# Altium schematic sheet [05] - DISP DRIVERS.SchDoc: DISPLAY DRIVERS
size 433 x 279 mm; Author: ZAG; DrawnBy: ZAG; DocumentNumber: 6; SheetNumber: 5; SheetTotal: 7; PageSetup: Record=PageOptions|CenterHorizontal=True|CenterVertical=True|PrintScale=0.96|XCorrection=1.00|YCorrection=1.00|PrintKind=2|BorderSize=5000000|LeftOffset=0|BottomOffset=0|Orientation=2|PaperLength=4318|PaperWidth=2794|Scale=100|PaperSource=15|PrintQuality=600|MediaType=1|DitherType=10|PaperKind=11x17|PrintScaleMode=1; ClientCompanyName: Mule Labs, LLC; ClientContactEmail: zack@mule-labs.com; PCBRevision: 01; SchRevision: 01; Project: YOUTUBE SUBSCRIBER COUNTER; SchStatus: PRELIMINARY
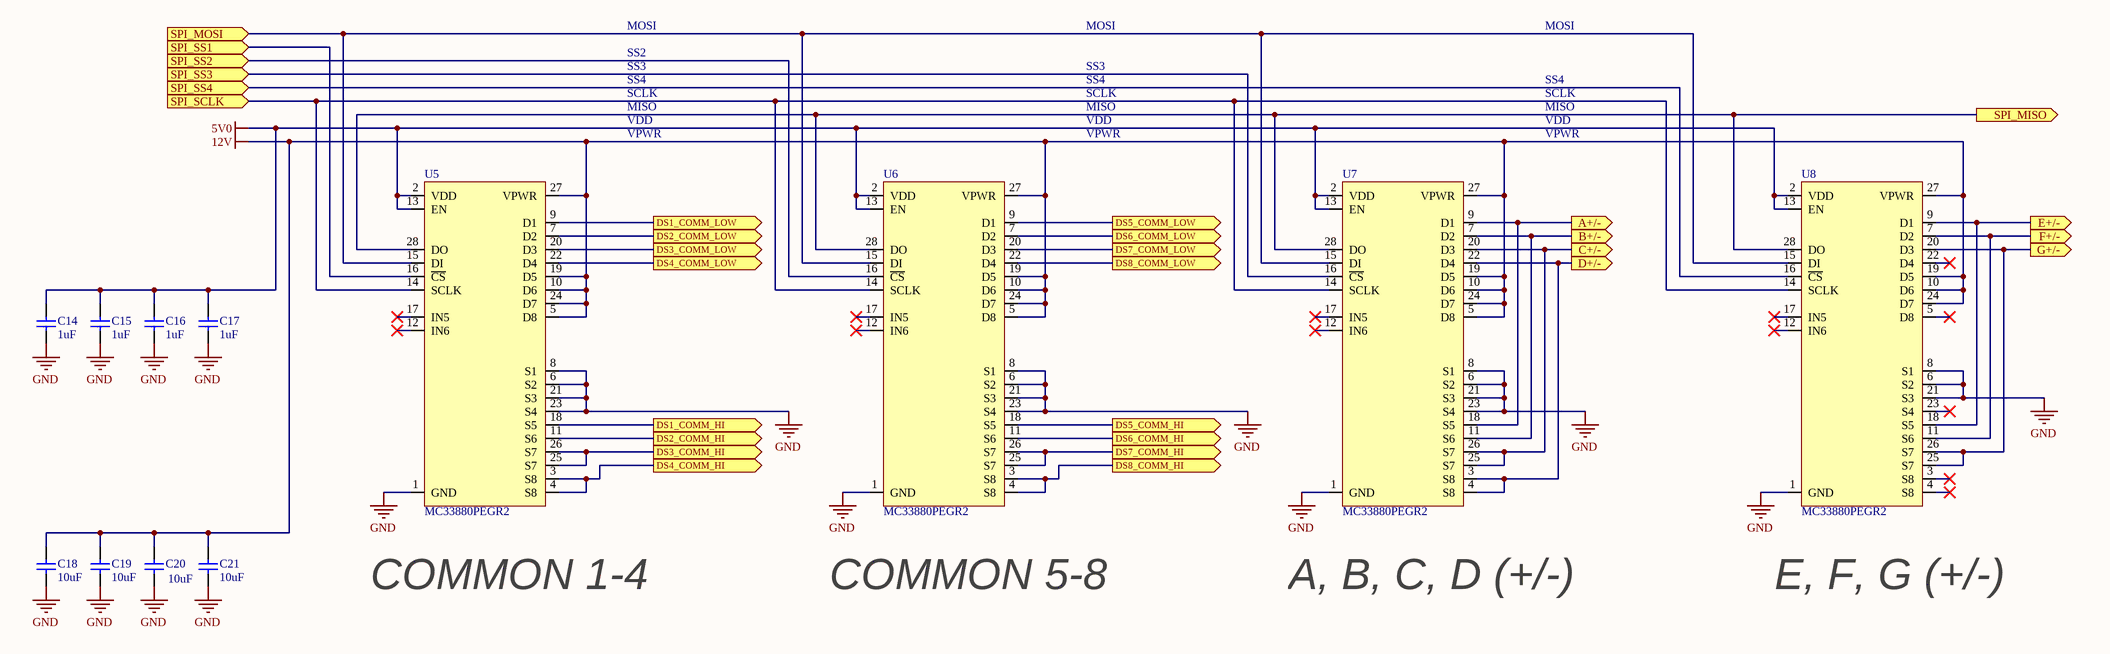
[diagram p0: [05] - DISP DRIVERS.SchDoc]

## Parts
C14  1uF  [INCH 0603 - METRIC 1608 - H090]
C15  1uF  [INCH 0603 - METRIC 1608 - H090]
C16  1uF  [INCH 0603 - METRIC 1608 - H090]
C17  1uF  [INCH 0603 - METRIC 1608 - H090]
C18  10uF  [INCH 0805 - METRIC 2012 - H140]
C19  10uF  [INCH 0805 - METRIC 2012 - H140]
C20  10uF  [INCH 0805 - METRIC 2012 - H140]
C21  10uF  [INCH 0805 - METRIC 2012 - H140]
U5  MC33880PEGR2  [SOIC28P127_1792X1030X265L65X42]
U6  MC33880PEGR2  [SOIC28P127_1792X1030X265L65X42]
U7  MC33880PEGR2  [SOIC28P127_1792X1030X265L65X42]
U8  MC33880PEGR2  [SOIC28P127_1792X1030X265L65X42]

## Ports
A+/- (out), B+/- (out), C+/- (out), D+/- (out), DS1_COMM_HI (out), DS1_COMM_LOW (out), DS2_COMM_HI (out), DS2_COMM_LOW (out), DS3_COMM_HI (out), DS3_COMM_LOW (out), DS4_COMM_HI (out), DS4_COMM_LOW (out), DS5_COMM_HI (out), DS5_COMM_LOW (out), DS6_COMM_HI (out), DS6_COMM_LOW (out), DS7_COMM_HI (out), DS7_COMM_LOW (out), DS8_COMM_HI (out), DS8_COMM_LOW (out), E+/- (out), F+/- (out), G+/- (out), SPI_MISO (out), SPI_MOSI (in), SPI_SCLK (in), SPI_SS1 (in), SPI_SS2 (in), SPI_SS3 (in), SPI_SS4 (in)

## Nets
5V0: C14.1 C15.1 C16.1 C17.1 U5.2(VDD) U5.13(EN) U6.2(VDD) U6.13(EN) U7.2(VDD) U7.13(EN) U8.2(VDD) U8.13(EN)
12V: C18.1 C19.1 C20.1 C21.1 U5.5(D8) U5.10(D6) U5.19(D5) U5.24(D7) U5.27(VPWR) U6.5(D8) U6.10(D6) U6.19(D5) U6.24(D7) U6.27(VPWR) U7.5(D8) U7.10(D6) U7.19(D5) U7.24(D7) U7.27(VPWR) U8.10(D6) U8.19(D5) U8.24(D7) U8.27(VPWR)
GND: C14.2 C15.2 C16.2 C17.2 C18.2 C19.2 C20.2 C21.2 U5.1(GND) U5.6(S2) U5.8(S1) U5.21(S3) U5.23(S4) U6.1(GND) U6.6(S2) U6.8(S1) U6.21(S3) U6.23(S4) U7.1(GND) U7.6(S2) U7.8(S1) U7.21(S3) U7.23(S4) U8.1(GND) U8.6(S2) U8.8(S1) U8.21(S3)
A+/-: U7.9(D1) U7.18(S5) ; port A+/-
B+/-: U7.7(D2) U7.11(S6) ; port B+/-
C+/-: U7.20(D3) U7.25(S7) U7.26(S7) ; port C+/-
D+/-: U7.3(S8) U7.4(S8) U7.22(D4) ; port D+/-
DS1_COMM_HI: U5.18(S5) ; port DS1_COMM_HI
DS1_COMM_LOW: U5.9(D1) ; port DS1_COMM_LOW
DS2_COMM_HI: U5.11(S6) ; port DS2_COMM_HI
DS2_COMM_LOW: U5.7(D2) ; port DS2_COMM_LOW
DS3_COMM_HI: U5.25(S7) U5.26(S7) ; port DS3_COMM_HI
DS3_COMM_LOW: U5.20(D3) ; port DS3_COMM_LOW
DS4_COMM_HI: U5.3(S8) U5.4(S8) ; port DS4_COMM_HI
DS4_COMM_LOW: U5.22(D4) ; port DS4_COMM_LOW
DS5_COMM_HI: U6.18(S5) ; port DS5_COMM_HI
DS5_COMM_LOW: U6.9(D1) ; port DS5_COMM_LOW
DS6_COMM_HI: U6.11(S6) ; port DS6_COMM_HI
DS6_COMM_LOW: U6.7(D2) ; port DS6_COMM_LOW
DS7_COMM_HI: U6.25(S7) U6.26(S7) ; port DS7_COMM_HI
DS7_COMM_LOW: U6.20(D3) ; port DS7_COMM_LOW
DS8_COMM_HI: U6.3(S8) U6.4(S8) ; port DS8_COMM_HI
DS8_COMM_LOW: U6.22(D4) ; port DS8_COMM_LOW
E+/-: U8.9(D1) U8.18(S5) ; port E+/-
F+/-: U8.7(D2) U8.11(S6) ; port F+/-
G+/-: U8.20(D3) U8.25(S7) U8.26(S7) ; port G+/-
SPI_MISO: U5.28(DO) U6.28(DO) U7.28(DO) U8.28(DO) ; port SPI_MISO
SPI_MOSI: U5.15(DI) U6.15(DI) U7.15(DI) U8.15(DI) ; port SPI_MOSI
SPI_SCLK: U5.14(SCLK) U6.14(SCLK) U7.14(SCLK) U8.14(SCLK) ; port SPI_SCLK
SPI_SS1: U5.16(~{CS}) ; port SPI_SS1
SPI_SS2: U6.16(~{CS}) ; port SPI_SS2
SPI_SS3: U7.16(~{CS}) ; port SPI_SS3
SPI_SS4: U8.16(~{CS}) ; port SPI_SS4

Not connected (* = marked no-connect by the designer): U5 12(IN6)* 17(IN5)*; U6 12(IN6)* 17(IN5)*; U7 12(IN6)* 17(IN5)*; U8 3(S8)* 4(S8)* 5(D8)* 12(IN6)* 17(IN5)* 22(D4)* 23(S4)*

## Notes on the sheet
- MOSI
- SS2
- SCLK
- MISO
- SS3
- SS4
- VDD
- VPWR
- COMMON 1-4
- COMMON 5-8
- A, B, C, D (+/-)
- E, F, G (+/-)
- SHEET TITLE
- SCH REV:
- PROJECT NAME
- PCB REV:
- DATE:
- DRAWN BY
- CONTACT
- MANUFACTURER, OR SALE OF PROCESSES OR PRODUCTS WITHOUT THE EXPRESSED WRITTEN CONSENT OF
- THE INFORMATION CONTAINED HEREIN IS DEEMED TO BE CONFIDENTIAL, PROPRIETARY, AND A TRADE SECRET OF
- THIS INFORMATION MAY NOT BE USED, REPRODUCED, OR DISCLOSED AS THE DIRECT OR INDIRECT BASIS FOR THE DEVELOPMENT,
- SHEET
- MULE LABS, LLC
- www.mule-labs.com <http://www.mule-labs.com>
- OF
- SIZE: B
- DO NOT SCALE DRAWING

## Library data of the parts
C14-C17 = CL10B105KO8NNNC: CAP CER 1UF 16V X7R 0603; Manufacturer: Samsung; Material: Ceramic; Tolerance: 10%; Supplier 1: Digi-Key; Manufacturer Part Number: CL10B105KO8NNNC; Stock 1: 1367836; Pricing 1: 1=0.1, 10=0.046, 100=0.0207, 500=0.01478, 1000=0.01161 (USD); Mount: Surface Mount; Case/Package: 0603; Case Code (Metric): 1608; Case Code (Imperial): 0603; Min Operating Temperature: -55°C; Max Operating Temperature: 125°C; Packaging: Tape and Reel; Capacitance: 1uF; Voltage Rating: 16V; Dielectric: X7R; Voltage: 16V; Voltage Rating (DC): 16V; Length: 1.6mm; Height: 0.8mm; Width: 0.031inch; Thickness: 0.035inch; Depth: 0.8mm; Radiation Hardening: No; Lead Free: Lead Free; ComponentLink1URL: https://datasheet.ciiva.com/15195/getdatasheetpartid-357418-15195728.pdf; ComponentLink1Description: https://datasheet.ciiva.com/15195/getdatasheetpartid-357418-15195728.pdf; ComponentLink2URL: https://datasheet.ciiva.com/29198/458176-da-01-en-vs-kondensator-0603-29198478.pdf; ComponentLink2Description: https://datasheet.ciiva.com/29198/458176-da-01-en-vs-kondensator-0603-29198478.pdf; Supplier Part Number 1: 1276-1019-6-ND; Category: Capacitor
C18-C21 = GRM21BR61E106MA73L: CAP CER 10UF 25V X5R 0805; Manufacturer: Murata; Tolerance: 20%; Supplier 1: Digi-Key; Manufacturer Part Number: GRM21BR61E106MA73L; Stock 1: 30000; Pricing 1: 1=0.27, 10=0.184, 100=0.1044, 500=0.0737, 1000=0.06449 (USD); Mount: Surface Mount; Case/Package: 0805; Weight: 0.000335oz; Case Code (Metric): 2012; Case Code (Imperial): 0805; Min Operating Temperature: -55°C; Max Operating Temperature: 85°C; Capacitance: 10uF; Packaging: Tape and Reel; Dielectric: X5R; Voltage Rating: 25V; Termination: SMD/SMT; Composition: Ceramic; Voltage Rating (DC): 25V; Package Quantity: 3000; Length: 2mm; Height: 1.25mm; Width: 0.049inch; Thickness: 0.055inch; Depth: 1.25mm; REACH SVHC: No SVHC; Lead Free: Lead Free; Supplier Part Number 1: 490-10748-1-ND
U5-U8 = MC33880PEGR2: IC SRL SWITCH OCT W/SPI 28SOIC; Manufacturer: NXP Semiconductors; Max Power Dissipation: 1.3W; Number of Outputs: 8; Output Current: 800mA; Nominal Supply Current: 8mA; Interface: SPI; Fault Protection: Over Voltage; Supplier 1: Digikey; Manufacturer Part Number: MC33880PEGR2; Stock 1: 966; Pricing 1: 1 = 5.68000, 10 = 5.10000, 100 = 4.17890, 500 = 3.55742 (USD); Mount: Surface Mount; Case/Package: SOIC; Number of Pins: 28; Weight: 0.026676oz; Min Operating Temperature: -40°C; Max Operating Temperature: 125°C; Packaging: Tape and Reel; Package Quantity: 1000; Max Output Current: 800mA; Power Dissipation: 1.3W; Radiation Hardening: No; Halogen Free: Halogen Free; ComponentLink1URL: https://datasheet.ciiva.com/6607/mc33880-6607564.pdf?src-supplier=Digi-Key; ComponentLink1Description: https://datasheet.ciiva.com/6607/mc33880-6607564.pdf?src-supplier=Digi-Key; ComponentLink2URL: http://datasheet.octopart.com/MC33880PEGR2-Freescale-Semiconductor-datasheet-12526227.pdf?src-supplier=Freescale+Semiconductor; ComponentLink2Description: http://datasheet.octopart.com/MC33880PEGR2-Freescale-Semiconductor-datasheet-12526227.pdf?src-supplier=Freescale+Semiconductor; ComponentLink3URL: http://sigma.octopart.com/44489297/technical_drawing/Freescale-Semiconductor-MC33880PEGR2.pdf?src-supplier=Freescale+Semiconductor; ComponentLink3Description: http://sigma.octopart.com/44489297/technical_drawing/Freescale-Semiconductor-MC33880PEGR2.pdf?src-supplier=Freescale+Semiconductor; Supplier Part Number 1: 568-15169-1-ND